# Altium schematic sheet INR.SchDoc
size A4
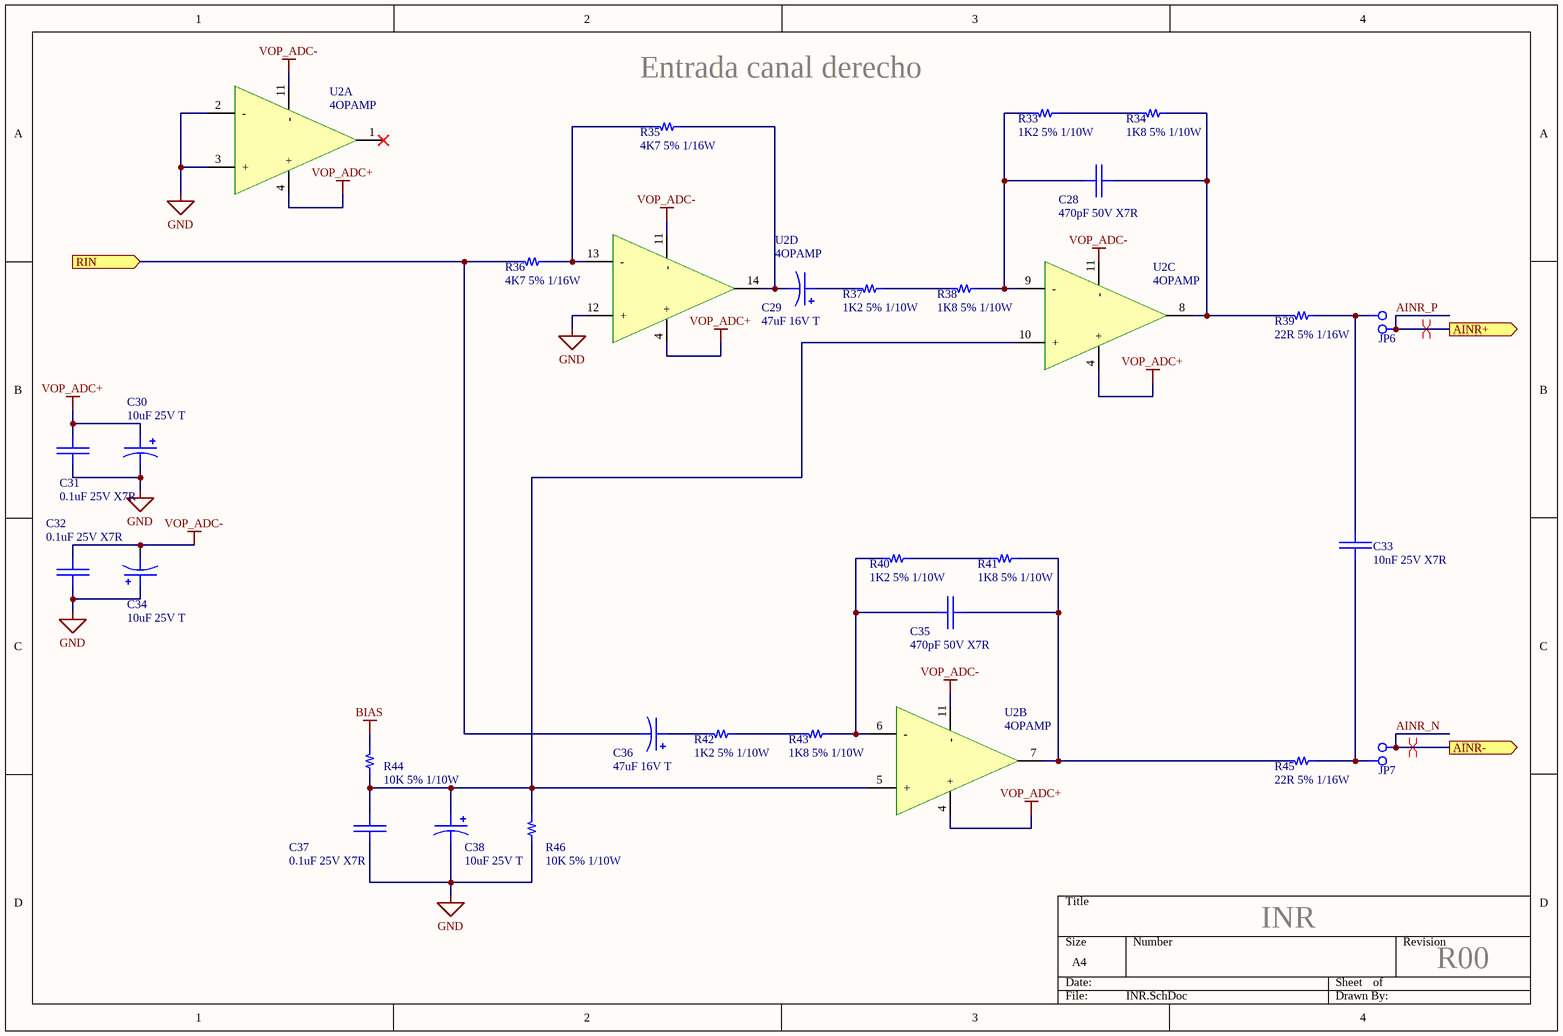
[diagram p0: INR.SchDoc]

## Parts
C28  470pF 50V X7R  [C_0805]
C29  47uF 16V T  [TANT]
C30  10uF 25V T  [TANT]
C31  0.1uF 25V X7R  [C_0805]
C32  0.1uF 25V X7R  [C_0805]
C33  10nF 25V X7R  [C_0805]
C34  10uF 25V T  [TANT]
C35  470pF 50V X7R  [C_0805]
C36  47uF 16V T  [TANT]
C37  0.1uF 25V X7R  [C_0805]
C38  10uF 25V T  [TANT]
JP6  Jumper 2x1  [Conn_2_1]  (value not drawn)
JP7  Jumper 2x1  [Conn_2_1]  (value not drawn)
R33  1K2 5% 1/10W  [R_0805]
R34  1K8 5% 1/10W  [R_0805]
R35  4K7 5% 1/16W  [R_0805]
R36  4K7 5% 1/16W  [R_0805]
R37  1K2 5% 1/10W  [R_0805]
R38  1K8 5% 1/10W  [R_0805]
R39  22R 5% 1/16W  [R_0805]
R40  1K2 5% 1/10W  [R_0805]
R41  1K8 5% 1/10W  [R_0805]
R42  1K2 5% 1/10W  [R_0805]
R43  1K8 5% 1/10W  [R_0805]
R44  10K 5% 1/10W  [R_0805]
R45  22R 5% 1/16W  [R_0805]
R46  10K 5% 1/10W  [R_0805]
U2  4OPAMP  [SOIC14]  (parts A,B,C,D of 4)

## Ports
AINR+ (out), AINR- (out), RIN (in)

## Nets
BIAS: R44.2
GND: C30.2 C31.2 C32.2 C34.1 C37.2 C38.2 R46.1 U2.2(-) U2.3(+) U2.12(+)
VOP_ADC+: C30.1 C31.1 U2.4(+)
VOP_ADC-: C32.1 C34.2 U2.11(-)
AINR_N: JP7.1 ; port AINR-
AINR_P: JP6.2 ; port AINR+
RIN: C36.2 R36.2 ; port RIN
NetC28_1: C28.1 R33.2 R38.1 U2.9(-)
NetC28_2: C28.2 R34.1 R39.2 U2.8(OUT)
NetC29_1: C29.1 R37.2
NetC29_2: C29.2 R35.1 U2.14(OUT)
NetC33_1: C33.1 JP7.2 R45.1
NetC33_2: C33.2 JP6.1 R39.1
NetC35_1: C35.1 R40.2 R43.1 U2.6(-)
NetC35_2: C35.2 R41.1 R45.2 U2.7(OUT)
NetC36_1: C36.1 R42.2
NetC37_1: C37.1 C38.1 R44.1 R46.2 U2.5(+) U2.10(+)
NetR33_1: R33.1 R34.2
NetR35_2: R35.2 R36.1 U2.13(-)
NetR37_1: R37.1 R38.2
NetR40_1: R40.1 R41.2
NetR42_1: R42.1 R43.2

Not connected (* = marked no-connect by the designer): U2 1(OUT)*

## Layout directives
differential pair: AINR_N, AINR_P

## Notes on the sheet
- (near R35) Entrada canal derecho
- INR
- R00

## Library data of the parts
C28 C35 = Capacitor: Capacitor de placas paralelas; Encapsulado: 0805; Cod. Proveedor: -; Proveedor: -
C29 C30 C34 C36 C38 = CapaPol: Capacitor polarizado; Encapsulado: TH; Cod. Proveedor: -; Proveedor: -
C31 C32 = Capacitor: Capacitor de placas paralelas; Cod. Proveedor: CA3289100; Encapsulado: 0603; Proveedor: Elemon
C33 C37 = Capacitor: Capacitor de placas paralelas
R33 R37 R40 R42 R44 R46 = Resistor: Resistencia; Encapsulado: 0805; Cod. Proveedor: -; Proveedor: -
R34 R38 R41 R43 = Resistor: Resistencia; Cod. Proveedor: RS3896200; Encapsulado: 0805; Proveedor: Elemon
R35 R36 = Resistor: Resistencia; Cod. Proveedor: RS3896225; Proveedor: Elemon; Encapsulado: 0805
R39 R45 = Resistor: Resistencia; Encapsulado: 0603; Cod. Proveedor: -; Proveedor: -
U2 = 4OPAMP: Integrado con 4 operacionales